# Altium schematic sheet PT100_SIG.SchDoc
size A4; SheetNumber: 2; SheetTotal: 10
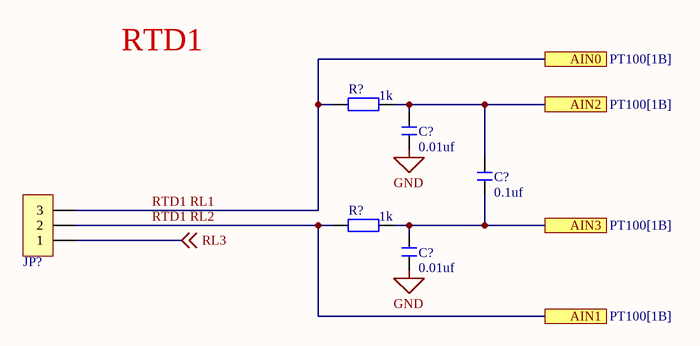
[diagram p0: PT100_SIG.SchDoc]

## Parts
(Parts that share a designator on the sheet are numbered #1, #2 ... from top to bottom, then left to right.)
C?#1  0.01uf  [C 0603_L]
C?#2  0.1uf  [C 0603_L]
C?#3  0.01uf  [C 0603_L]
JP?  HDR-1X3  [XH2.54-WI-3P]  (value not drawn)
R?#1  1k  [R 0603_L]
R?#2  1k  [R 0603_L]

## Ports
AIN0 (see PT100[1B]), AIN1 (see PT100[1B]), AIN2 (see PT100[1B]), AIN3 (see PT100[1B])

## Nets
GND: C?#1.1 C?#3.1
AIN2: C?#1.2 C?#2.2 R?#1.2 ; port AIN2
AIN3: C?#2.1 C?#3.2 R?#2.2 ; port AIN3
RL3: JP?.1 ; off-sheet RL3
RTD1 RL1: JP?.3 R?#1.1 ; port AIN0
RTD1 RL2: JP?.2 R?#2.1 ; port AIN1

## Notes on the sheet
- RTD1

## Library data of the parts
C?#1-C?#3 = C: 贴片电容; BOM名称: 无极性贴片电容; 淘宝ID: 封装库来自淘宝 ID：黄晶宝石; 联系售后，技术支持: https://shop463601444.taobao.com; 唯一出售店铺网址: https://shop463601444.taobao.com
JP? = Header 3: 3P接插件; 版权归属: 封装库来自淘宝 ID：黄晶宝石; BOM名称: 3P接插件; 学习资源: https://shop463601444.taobao.com
R?#1 R?#2 = 0805 电阻: 贴片电阻 0805 电阻; ComponentLink1Description: 供应商链接; ComponentLink1URL: http://www.szlcsc.com/product/details_18165.html; Package: 0805; Supplier: LC; SuppliersPartNumber: C17477